# EasyEDA schematic arduino_learning_cube.json
TITLE: Arduino Learning Cube; REV: 1.0; Date: 2019-02-18; Sheet: 1/1; Drawn By: snug@hackerspace-bremen.de; Company: Hackerspace Bremen
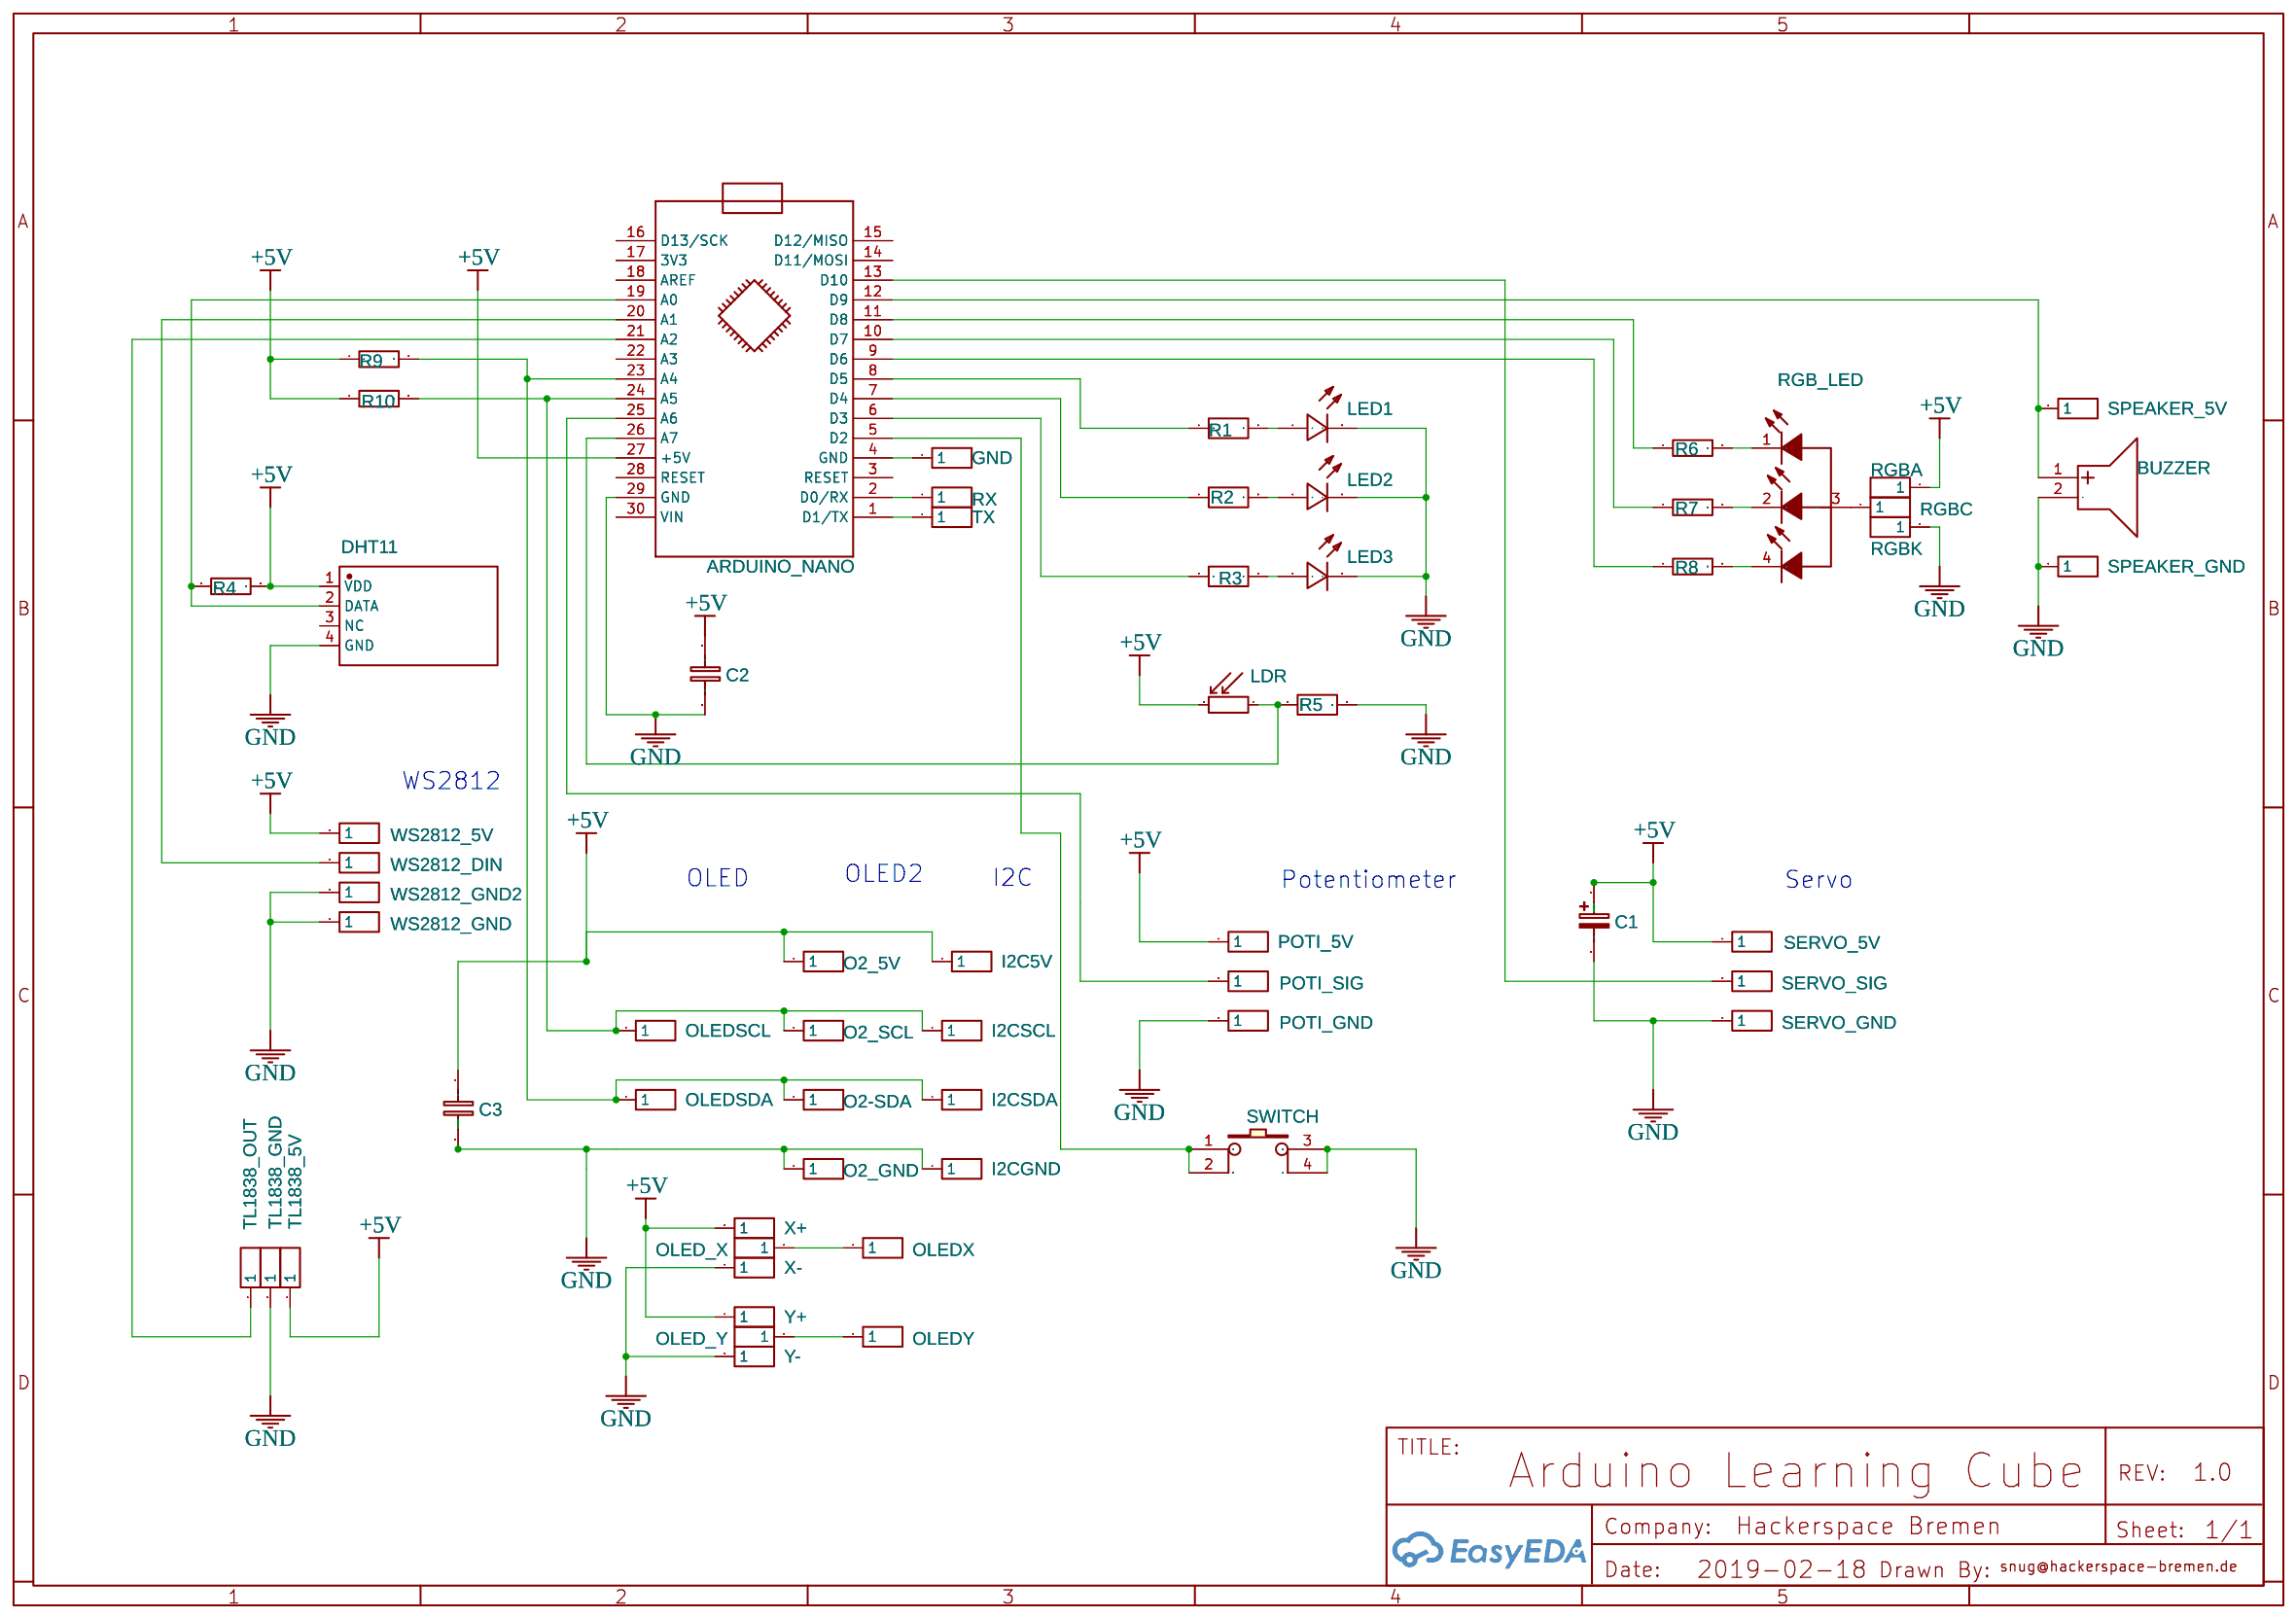
[diagram p0: schematic sheet]

## Parts
ARDUINO_NANO  ARDUINO_NANO  [ARDUINO_NANO]
BUZZER  ZL-DCY12075-2705P-7.6  [BUZZER-R6.0-2P-7.6MM]
C1  1u  [CAP-D8.0XF3.5]
C2  1u  [RAD-0.1]
C3  1u  [RAD-0.1]
DHT11  DHT11  [DHT11]
GND  Header-Male-2.54_1x1  [HDR-1X1/2.54]
I2C5V  Header-Male-2.54_1x1  [HDR-1X1/2.54]
I2CGND  Header-Male-2.54_1x1  [HDR-1X1/2.54]
I2CSCL  Header-Male-2.54_1x1  [HDR-1X1/2.54]
I2CSDA  Header-Male-2.54_1x1  [HDR-1X1/2.54]
LDR  LDR07  [RESISTOR_LDR_5.1X4.3_RM3.4]
LED1  LED-3MM  [LED-3MM/2.54]
LED2  LED-3MM  [LED-3MM/2.54]
LED3  LED-3MM  [LED-3MM/2.54]
O2-SDA  Header-Male-2.54_1x1  [HDR-1X1/2.54]
O2_5V  Header-Male-2.54_1x1  [HDR-1X1/2.54]
O2_GND  Header-Male-2.54_1x1  [HDR-1X1/2.54]
O2_SCL  Header-Male-2.54_1x1  [HDR-1X1/2.54]
OLED_X  Header-Male-2.54_1x1  [HDR-1X1/2.54]
OLED_Y  Header-Male-2.54_1x1  [HDR-1X1/2.54]
OLEDSCL  Header-Male-2.54_1x1  [HDR-1X1/2.54]
OLEDSDA  Header-Male-2.54_1x1  [HDR-1X1/2.54]
OLEDX  Header-Male-2.54_1x1  [HDR-1X1/2.54]
OLEDY  Header-Male-2.54_1x1  [HDR-1X1/2.54]
POTI_5V  Header-Male-2.54_1x1  [HDR-1X1/2.54]
POTI_GND  Header-Male-2.54_1x1  [HDR-1X1/2.54]
POTI_SIG  Header-Male-2.54_1x1  [HDR-1X1/2.54]
R1  100  [AXIAL-0.3]
R2  100  [AXIAL-0.3]
R3  100  [AXIAL-0.3]
R4  1k  [AXIAL-0.3]
R5  1k  [AXIAL-0.3]
R6  1k  [AXIAL-0.3]
R7  1k  [AXIAL-0.3]
R8  1k  [AXIAL-0.3]
R9  1k  [AXIAL-0.3]
R10  1k  [AXIAL-0.3]
RGB_LED  φ5 RGB Transparent  [RGB-5MM]
RGBA  Header-Male-2.54_1x1  [HDR-1X1/2.54]
RGBC  Header-Male-2.54_1x1  [HDR-1X1/2.54]
RGBK  Header-Male-2.54_1x1  [HDR-1X1/2.54]
RX  Header-Male-2.54_1x1  [HDR-1X1/2.54]
SERVO_5V  Header-Male-2.54_1x1  [HDR-1X1/2.54]
SERVO_GND  Header-Male-2.54_1x1  [HDR-1X1/2.54]
SERVO_SIG  Header-Male-2.54_1x1  [HDR-1X1/2.54]
SPEAKER_5V  Header-Male-2.54_1x1  [HDR-1X1/2.54]
SPEAKER_GND  Header-Male-2.54_1x1  [HDR-1X1/2.54]
SWITCH  SWITCH  [SWITCH-6X6X5_TH]
TL1838_5V  Header-Male-2.54_1x1  [HDR-1X1/2.54]
TL1838_GND  Header-Male-2.54_1x1  [HDR-1X1/2.54]
TL1838_OUT  Header-Male-2.54_1x1  [HDR-1X1/2.54]
TX  Header-Male-2.54_1x1  [HDR-1X1/2.54]
WS2812_5V  Header-Male-2.54_1x1  [HDR-1X1/2.54]
WS2812_DIN  Header-Male-2.54_1x1  [HDR-1X1/2.54]
WS2812_GND  Header-Male-2.54_1x1  [HDR-1X1/2.54]
WS2812_GND2  Header-Male-2.54_1x1  [HDR-1X1/2.54]
X+  Header-Male-2.54_1x1  [HDR-1X1/2.54]
X-  Header-Male-2.54_1x1  [HDR-1X1/2.54]
Y+  Header-Male-2.54_1x1  [HDR-1X1/2.54]
Y-  Header-Male-2.54_1x1  [HDR-1X1/2.54]

## Library data of the parts
ARDUINO_NANO = -: sourceId: KGSeAWhDB; Manufacturer Part: ?
BUZZER = -: Supplier: LCSC; Supplier Part: C194535; Manufacturer: ZLFY; Contributor: LCSC
C1 = Cap_Electrolytic(TH)_D8.0XF3.5_EU: Contributor: EasyEDA; Manufacturer Part: ?
C2 C3 = Cap_RAD-0.1_EU: Manufacturer Part: ?
DHT11 = -: Supplier: LCSC; Supplier Part: C117051; Manufacturer: Aosong (Guangzhou) Elec; Contributor: LCSC
GND I2C5V I2CGND I2CSCL I2CSDA O2-SDA O2_5V O2_GND O2_SCL OLED_X OLED_Y OLEDSCL OLEDSDA OLEDX OLEDY POTI_5V POTI_GND POTI_SIG RGBA RGBC RGBK RX SERVO_5V SERVO_GND SERVO_SIG SPEAKER_5V SPEAKER_GND TL1838_5V TL1838_GND TL1838_OUT TX WS2812_5V WS2812_DIN WS2812_GND WS2812_GND2 X+ X- Y+ Y- = -: Supplier: LCSC; Manufacturer: ReliaPro; Supplier Part: C81276
LDR = -: Contributor: KiCAD; license: https://www.gnu.org/licenses/lgpl-2.1.html; Manufacturer Part: ?
LED1-LED3 = -: Supplier: LCSC; Manufacturer: EVERLIGHT; Manufacturer Part: 204-10SURD/S530-A3; Supplier Part: C99772
R1-R10 = Res_AXIAL-0.3(1/8W)_EU: Manufacturer Part: ?
RGB_LED = -: Supplier: LCSC; Manufacturer: KENTO; Manufacturer Part: φ5 RGB Transparent LED; Contributor: LCSC; Supplier Part: C32985
SWITCH = -: Supplier Part: C111992; Supplier: LCSC; Manufacturer: HRO; Manufacturer Part: K2-1102DP-K4SW-04

## Nets
+5V: ARDUINO_NANO.27(+5V) C1.1 C2.1 C3.1 DHT11.1(VDD) I2C5V.1 LDR.2 O2_5V.1 POTI_5V.1 R4.2 R9.1 R10.1 RGBA.1 SERVO_5V.1 TL1838_5V.1 WS2812_5V.1 X+.1 Y+.1
GND: ARDUINO_NANO.29(GND) BUZZER.2(-) C1.2 C2.2 C3.2 DHT11.4(GND) I2CGND.1 LED1.2(-) LED2.2(-) LED3.2(-) O2_GND.1 POTI_GND.1 R5.2 RGBK.1 SERVO_GND.1 SPEAKER_GND.1 SWITCH.3 SWITCH.4 TL1838_GND.1 WS2812_GND.1 WS2812_GND2.1 X-.1 Y-.1
Net-(ARDUINO_NANO-1): ARDUINO_NANO.1(D1/TX) TX.1
Net-(ARDUINO_NANO-2): ARDUINO_NANO.2(D0/RX) RX.1
Net-(ARDUINO_NANO-4): ARDUINO_NANO.4(GND) GND.1
Net-(ARDUINO_NANO-5): ARDUINO_NANO.5(D2) SWITCH.1 SWITCH.2
Net-(ARDUINO_NANO-6): ARDUINO_NANO.6(D3) R3.1
Net-(ARDUINO_NANO-7): ARDUINO_NANO.7(D4) R2.1
Net-(ARDUINO_NANO-8): ARDUINO_NANO.8(D5) R1.1
Net-(ARDUINO_NANO-9): ARDUINO_NANO.9(D6) R8.1
Net-(ARDUINO_NANO-10): ARDUINO_NANO.10(D7) R7.1
Net-(ARDUINO_NANO-11): ARDUINO_NANO.11(D8) R6.1
Net-(ARDUINO_NANO-12): ARDUINO_NANO.12(D9) BUZZER.1(+) SPEAKER_5V.1
Net-(ARDUINO_NANO-13): ARDUINO_NANO.13(D10) SERVO_SIG.1
Net-(ARDUINO_NANO-19): ARDUINO_NANO.19(A0) DHT11.2(DATA) R4.1
Net-(ARDUINO_NANO-20): ARDUINO_NANO.20(A1) WS2812_DIN.1
Net-(ARDUINO_NANO-21): ARDUINO_NANO.21(A2) TL1838_OUT.1
Net-(ARDUINO_NANO-23): ARDUINO_NANO.23(A4) I2CSDA.1 O2-SDA.1 OLEDSDA.1 R9.2
Net-(ARDUINO_NANO-24): ARDUINO_NANO.24(A5) I2CSCL.1 O2_SCL.1 OLEDSCL.1 R10.2
Net-(ARDUINO_NANO-25): ARDUINO_NANO.25(A6) POTI_SIG.1
Net-(ARDUINO_NANO-26): ARDUINO_NANO.26(A7) LDR.1 R5.1
Net-(LED1-1): LED1.1(+) R1.2
Net-(LED2-1): LED2.1(+) R2.2
Net-(LED3-1): LED3.1(+) R3.2
Net-(OLED_X-1): OLED_X.1 OLEDX.1
Net-(OLED_Y-1): OLED_Y.1 OLEDY.1
Net-(R6-2): R6.2 RGB_LED.1(K)
Net-(R7-2): R7.2 RGB_LED.2(K)
Net-(R8-2): R8.2 RGB_LED.4(K)
Net-(RGB_LED-3): RGB_LED.3(A) RGBC.1

Not connected (* = marked no-connect by the designer): ARDUINO_NANO 3(RESET) 14(D11/MOSI) 15(D12/MISO) 16(D13/SCK) 17(3V3) 18(AREF) 22(A3) 28(RESET) 30(VIN); DHT11 3(NC)

## Notes on the sheet
- WS2812
- OLED
- OLED2
- I2C
- Potentiometer
- Servo
